# Altium project 32pinFFC_Breakout.PrjPcb
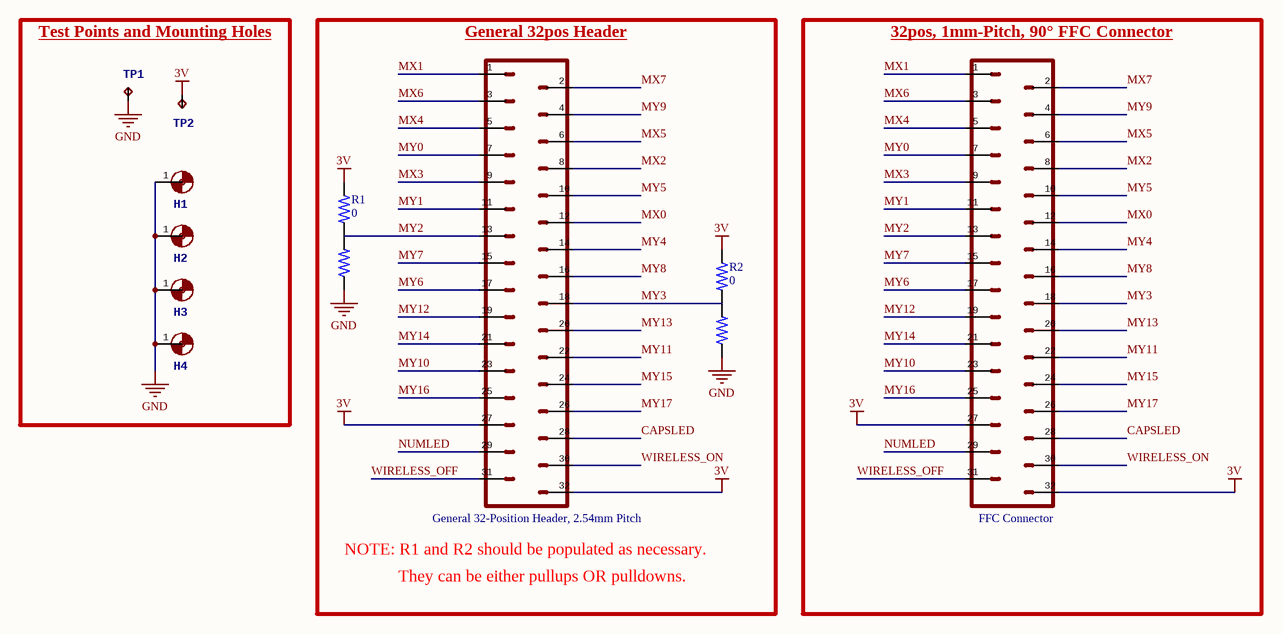
[diagram p0: 32pinFFC_Breakout_SCHEM.SchDoc]
1 sheet, 10 parts. Net scope: global (net labels, ports and power ports of the same name join across sheets).
Board file: 32pinFFC_Breakout_PCB.PcbDoc

## Sheet 32pinFFC_Breakout_SCHEM.SchDoc
size 1016 x 660 mm

### Parts
FFC_Connector  hanetzer FFC Connector  [Hanetzer 32Pin FCC Connector]  (value not drawn)
General_32-Position_Header,_2.54mm_Pitch  hanetzer header  [hanetzer header]  (value not drawn)
H1  Mounting Hole  [MntHole-M2.5x4mm]  (value not drawn)  (no BOM)
H2  Mounting Hole  [MntHole-M2.5x4mm]  (value not drawn)  (no BOM)
H3  Mounting Hole  [MntHole-M2.5x4mm]  (value not drawn)  (no BOM)
H4  Mounting Hole  [MntHole-M2.5x4mm]  (value not drawn)  (no BOM)
R1  0  [R0603_1608_Three_Pad]
R2  0  [R0603_1608_Three_Pad]
TP1  TestPt  [TP1]  (value not drawn)
TP2  TestPt  [TP1_ROUND]  (value not drawn)

### Nets
3V: FFC_Connector.27 FFC_Connector.32 General_32-Position_Header,_2.54mm_Pitch.27 General_32-Position_Header,_2.54mm_Pitch.32 R1.1 R2.1 TP2.TP
GND: H1.1 H2.1 H3.1 H4.1 R1.3 R2.3 TP1.TP
CAPSLED: FFC_Connector.28 General_32-Position_Header,_2.54mm_Pitch.28
MX0: FFC_Connector.12 General_32-Position_Header,_2.54mm_Pitch.12
MX1: FFC_Connector.1 General_32-Position_Header,_2.54mm_Pitch.1
MX2: FFC_Connector.8 General_32-Position_Header,_2.54mm_Pitch.8
MX3: FFC_Connector.9 General_32-Position_Header,_2.54mm_Pitch.9
MX4: FFC_Connector.5 General_32-Position_Header,_2.54mm_Pitch.5
MX5: FFC_Connector.6 General_32-Position_Header,_2.54mm_Pitch.6
MX6: FFC_Connector.3 General_32-Position_Header,_2.54mm_Pitch.3
MX7: FFC_Connector.2 General_32-Position_Header,_2.54mm_Pitch.2
MY0: FFC_Connector.7 General_32-Position_Header,_2.54mm_Pitch.7
MY1: FFC_Connector.11 General_32-Position_Header,_2.54mm_Pitch.11
MY2: FFC_Connector.13 General_32-Position_Header,_2.54mm_Pitch.13 R1.2
MY3: FFC_Connector.18 General_32-Position_Header,_2.54mm_Pitch.18 R2.2
MY4: FFC_Connector.14 General_32-Position_Header,_2.54mm_Pitch.14
MY5: FFC_Connector.10 General_32-Position_Header,_2.54mm_Pitch.10
MY6: FFC_Connector.17 General_32-Position_Header,_2.54mm_Pitch.17
MY7: FFC_Connector.15 General_32-Position_Header,_2.54mm_Pitch.15
MY8: FFC_Connector.16 General_32-Position_Header,_2.54mm_Pitch.16
MY9: FFC_Connector.4 General_32-Position_Header,_2.54mm_Pitch.4
MY10: FFC_Connector.23 General_32-Position_Header,_2.54mm_Pitch.23
MY11: FFC_Connector.22 General_32-Position_Header,_2.54mm_Pitch.22
MY12: FFC_Connector.19 General_32-Position_Header,_2.54mm_Pitch.19
MY13: FFC_Connector.20 General_32-Position_Header,_2.54mm_Pitch.20
MY14: FFC_Connector.21 General_32-Position_Header,_2.54mm_Pitch.21
MY15: FFC_Connector.24 General_32-Position_Header,_2.54mm_Pitch.24
MY16: FFC_Connector.25 General_32-Position_Header,_2.54mm_Pitch.25
MY17: FFC_Connector.26 General_32-Position_Header,_2.54mm_Pitch.26
NUMLED: FFC_Connector.29 General_32-Position_Header,_2.54mm_Pitch.29
WIRELESS_OFF: FFC_Connector.31 General_32-Position_Header,_2.54mm_Pitch.31
WIRELESS_ON: FFC_Connector.30 General_32-Position_Header,_2.54mm_Pitch.30

### Notes on the sheet
- Test Points and Mounting Holes
- (near General_32-Position_Header,_2.54mm_Pitch) NOTE: R1 and R2 should be populated as necessary.
- They can be either pullups OR pulldowns.
- General 32pos Header
- (near FFC_Connector) 32pos, 1mm-Pitch, 90° FFC Connector

### Library data of the parts
FFC_Connector = hanetzer FFC Connector: Manufacturer: Amphenol FCI; Manufacturer Part Number: HFW32S-2STE1LF; Current Rating: 1 A; Mounting Angle: Straight; Number of Positions: 32 Position; Voltage Rating: 100 VAC/DC; Pitch: 1 mm; Actuation Type: Non ZIF; Contact Location: Bottom Contact; Insulation Resistance: 500 MOhms; Supplier 1: Mouser; Supplier Part Number 1: 649-HFW32S-2STE1LF; RoHS: RoHS Compliant; Category: FFC & FPC Connectors; Stock 1: 1236; Pricing 1: 1=0.530, 10=0.393, 100=0.377, 500=0.327, 1000=0.270, 2000=0.246, 5000=0.238, 10000=0.221, 25000=0.218 (USD); Contact Plating: Tin; Housing Material: Polyamide (PA); Packaging: Cut Tape; Product: Board Mount; Series: HFW-S; Termination Style: SMD; Brand: Amphenol FCI; Contact Material: Phosphor Bronze; Maximum Operating Temperature: + 85 C; Minimum Operating Temperature: - 55 C; Standard Pack Qty: 1000; RoHS - Mouser: Y; Minimum Order Quantity: 1; Reeling: True; ComponentLink1URL: https://www.mouser.com/ds/2/18/sc-hfws06-943200.pdf; ComponentLink1Description: https://www.mouser.com/ds/2/18/sc-hfws06-943200.pdf
H1-H4 = MntHole_M2.5x4mm: Mount Hole for M2.5x4mm Machine Screws
R1 R2 = R0THREEPAD(0603/1608)_1: 0 Resistor; Manufacturer: Yageo; Manufacturer Part Number: RC0603FR-070RL; Resistance: 0 Ohms; Supplier 1: Mouser; Supplier Part Number 1: 603-RC0603FR-070RL; RoHS: RoHS Compliant By Exemption; Category: Thick Film Resistors - SMD; Stock 1: 686909; Pricing 1: 1=0.100, 10=0.010, 100=0.003, 1000=0.002, 5000=0.002, 10000=0.001 (USD); Height: 0.45 mm; Length: 1.6 mm; Operating Temperature Range: - 55 C to + 155 C; Package / Case: 0603 (1608 metric); Packaging: Reel; Power Rating: -; Product: Thick Film Resistors Zero-Ohm; Series: RC; Temperature Coefficient: -; Termination Style: SMD/SMT; Tolerance: -; Type: General Purpose Chip Resistor Surface Mount; Voltage Rating: -; Width: 0.8 mm; Brand: Yageo; Case Code - in: 0603; Case Code - mm: 1608; Standard Pack Qty: 5000; RoHS - Mouser: E; Minimum Order Quantity: 1; Reeling: True; ComponentLink1URL: http://www.mouser.com/ds/2/447/RC0603-272842.pdf; ComponentLink1Description: http://www.mouser.com/ds/2/447/RC0603-272842.pdf
TP1 = TPPAD: Test Point
TP2 = TPPAD_ROUND: Test Point